# EAGLE design JabberAmplifier (EAGLE 5.11)
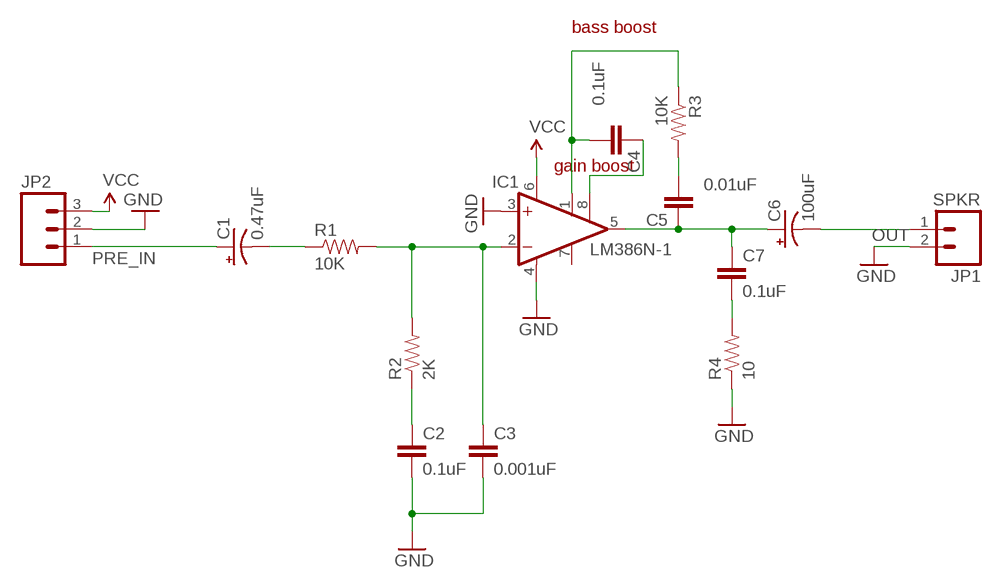
[diagram p0: schematic, sheet 1]

## Parts
C1  0.47uF  CAP_POLPTH2  [CPOL-RADIAL-10UF-25V]
C2  0.1uF  CAPPTH  [CAP-PTH-SMALL]
C3  0.001uF  CAPPTH  [CAP-PTH-SMALL]
C4  0.1uF  CAPPTH  [CAP-PTH-SMALL]
C5  0.01uF  CAPPTH  [CAP-PTH-SMALL]
C6  100uF  CAP_POLPTH2  [CPOL-RADIAL-10UF-25V]
C7  0.1uF  CAPPTH  [CAP-PTH-SMALL]
IC1  LM386N-1  [DIL08]
JP1  SPKR  M02POLAR_LOCK  [MOLEX-1X2_LOCK]
JP2  M03POLAR  [MOLEX-1X3]
R1  10K  RESISTORAXIAL-0.3  [AXIAL-0.3]
R2  2K  RESISTORAXIAL-0.3  [AXIAL-0.3]
R3  10K  RESISTORAXIAL-0.3  [AXIAL-0.3]
R4  10  RESISTORAXIAL-0.3  [AXIAL-0.3]

## Nets
GND: C2.2 C3.2 IC1.3(+IN) IC1.4(GND) JP1.2 JP2.2 R4.P$1
N$1: C1.2(-) R1.P$1
N$2: C3.1 IC1.2(-IN) R1.P$2 R2.P$2
N$3: C2.1 R2.P$1
N$4: C5.1 C6.1(+) C7.1 IC1.5(OUT)
N$5: C7.2 R4.P$2
N$6: C4.1 IC1.8(GAIN)
N$7: C5.2 R3.P$2
N$8: C4.2 IC1.1(GAIN) R3.P$1
OUT: C6.2(-) JP1.1
PRE_IN: C1.1(+) JP2.1
VCC: IC1.6(VS) JP2.3
Unconnected: IC1.7(BYPASS)

## Notes on the sheet
- bass boost
- gain boost

## Library data of the parts
C1 C6 = SparkFun:CAP_POL: Capacitor Polarized These are standard SMD and PTH capacitors. Normally 10uF, 47uF, and 100uF in electrolytic and tantalum varieties. Always verify the external diameter of the through hole cap, it varies with capacity, voltage, and manufacturer. The EIA devices should be standard.
C2-C5 C7 = SparkFun:CAP: Capacitor Standard 0603 ceramic capacitor, and 0.1" leaded capacitor.
IC1 = linear:LM386?-*: Low Voltage Audio Power Amplifier Source: http://cache.national.com/ds/LM/LM386.pdf
JP1 = SparkFun:M02: Header 2 Standard 2-pin 0.1" header. Use with straight break away headers (SKU : PRT-00116), right angle break away headers (PRT-00553), swiss pins (PRT-00743), machine pins (PRT-00117), and female headers (PRT-00115). Molex polarized connector foot print use with SKU : PRT-08233 with associated crimp pins and housings.
JP2 = SparkFun:M03: Header 3 Standard 3-pin 0.1" header. Use with straight break away headers (SKU : PRT-00116), right angle break away headers (PRT-00553), swiss pins (PRT-00743), machine pins (PRT-00117), and female headers (PRT-00115). Molex polarized connector foot print use with SKU : PRT-08232 with associated crimp pins and housings.
R1-R4 = SparkFun:RESISTOR: Resistor Basic schematic elements and footprints for 0603, 1206, and PTH resistors.

## Board
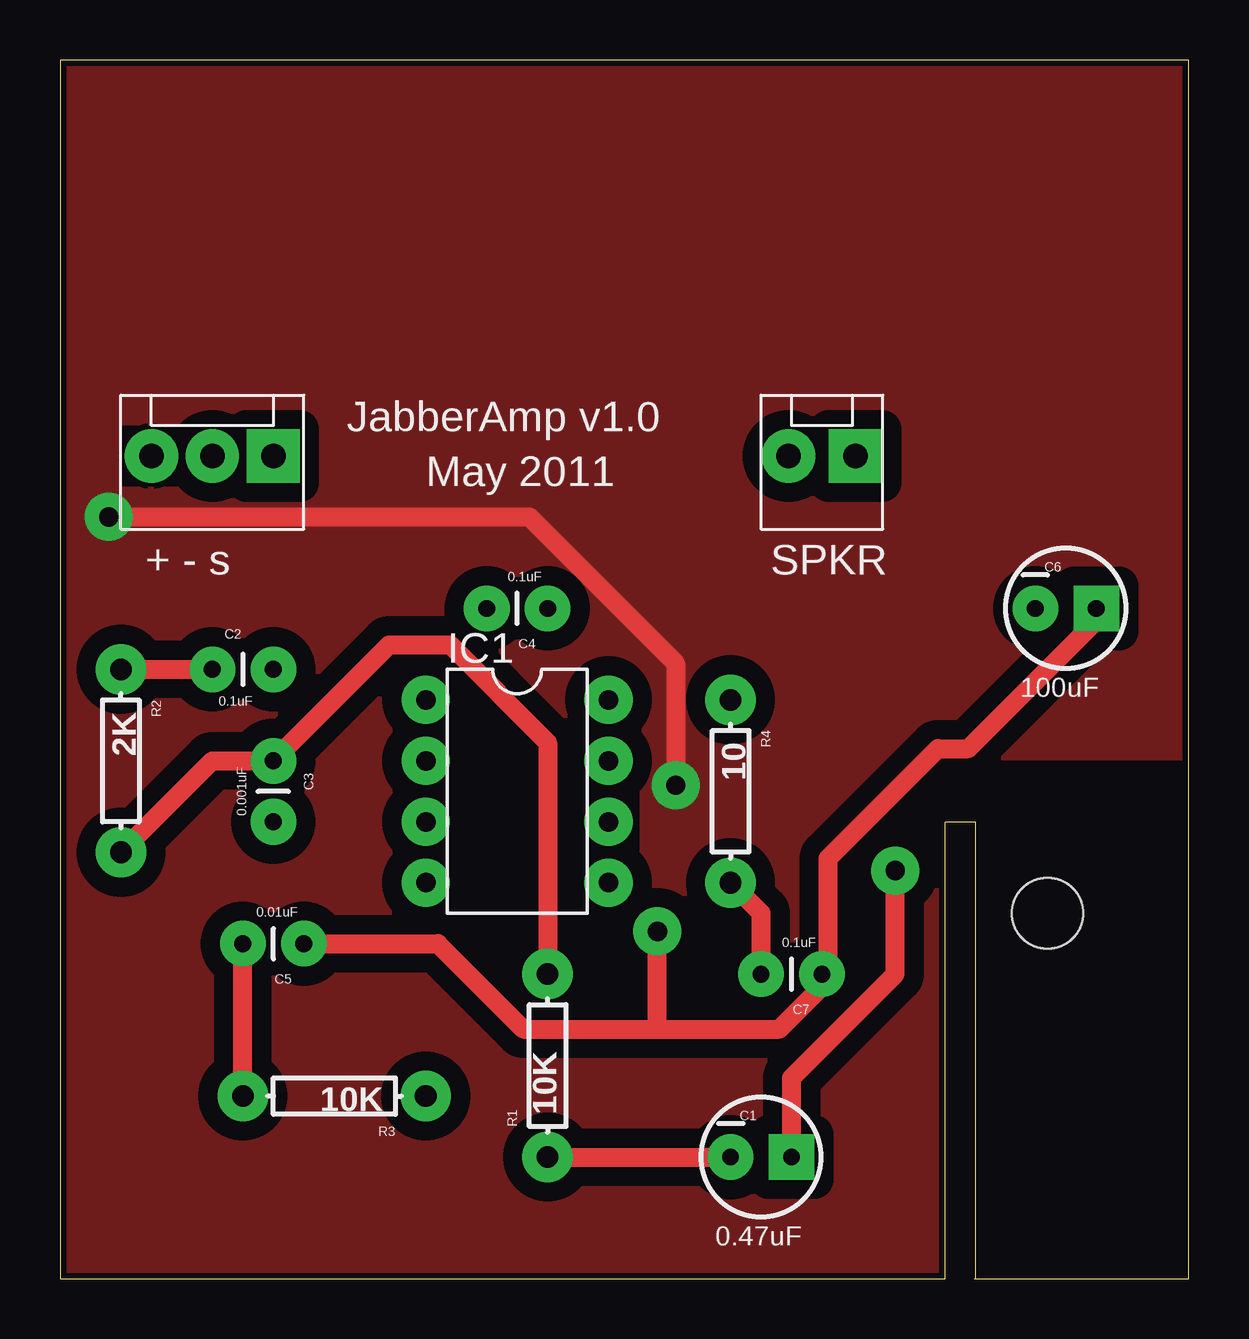
[diagram p1: board, top side]
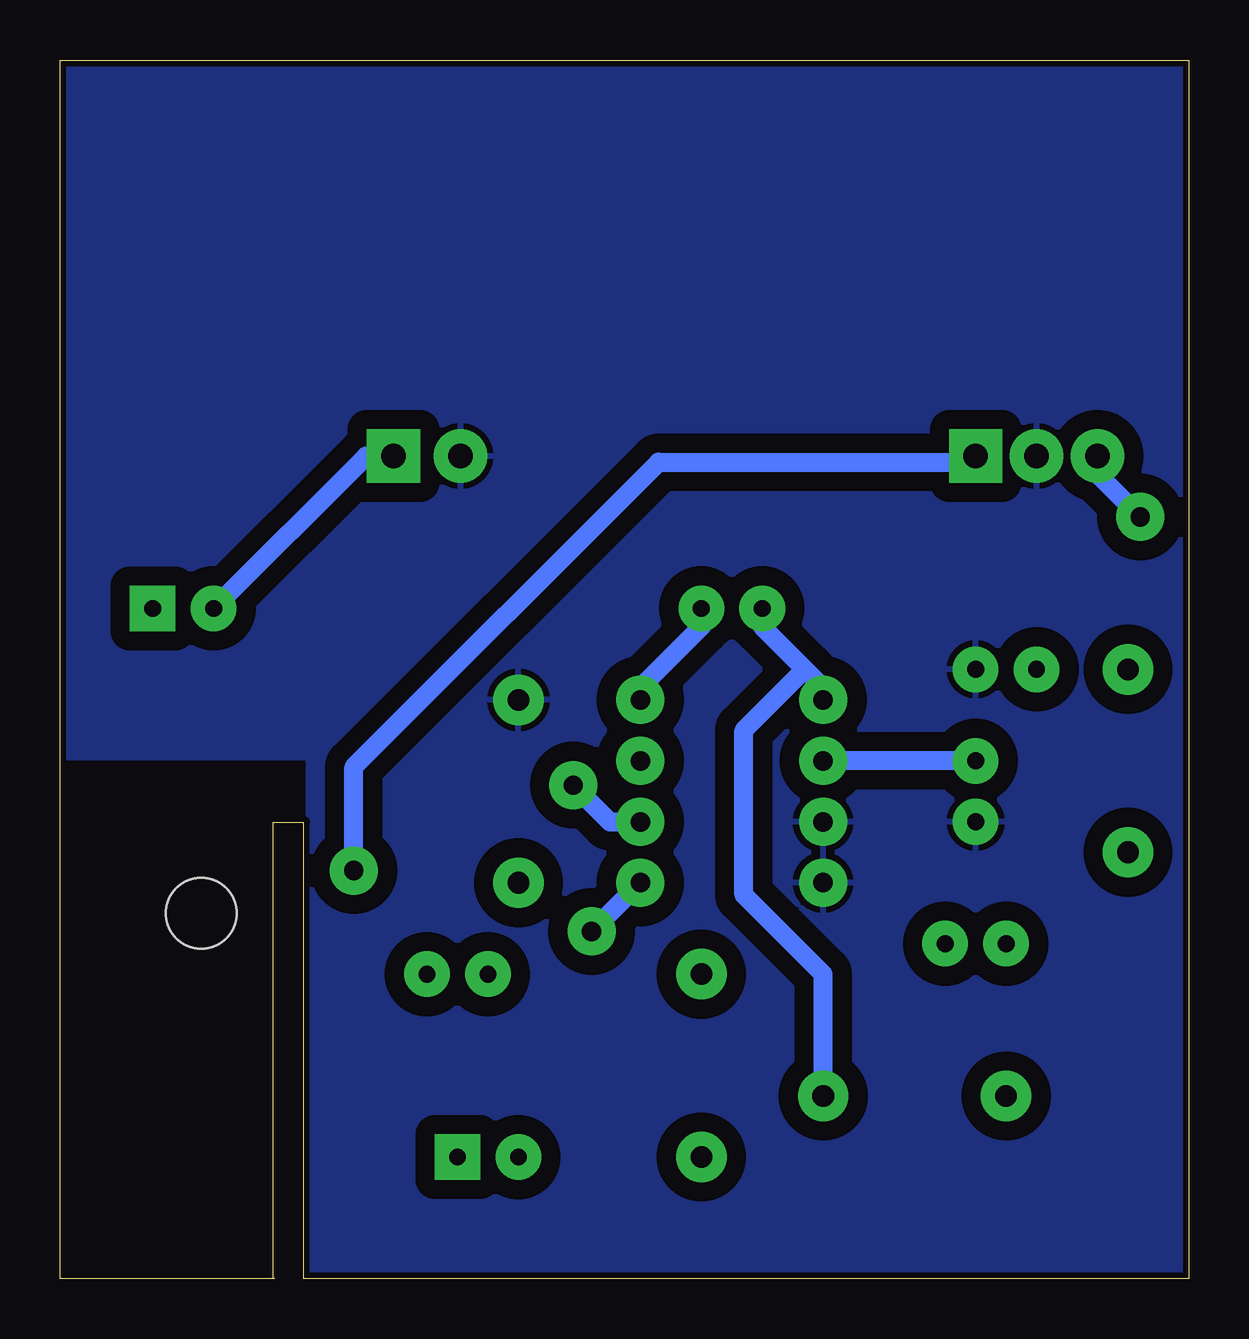
[diagram p2: board, bottom side, seen from below]

Size 47.04 x 50.79 mm. Coordinates in mm from the lower left corner, seen from the top.
Outline: 38.15,0 38.15,19.04 36.88,19.04 36.88,0 0,0 0,50.79 47.04,50.79 47.04,0 38.1,0
Copper layers (1*16): Top 0.035mm / dielectric 1.5mm / Bottom 0.035mm
Design rules "hobby": minimum track width 0.8mm, minimum drill 0.8mm, track to track 0.8mm, track to pad 0.8mm, pad to pad 0.45mm, via to via 0.8mm, smd to smd 8mil, copper to edge 10mil, drill to drill 8mil, minimum pad ring 0.6mm, minimum via ring 0.6mm, stop-mask expansion 4mil, vias tented up to drill 25mil, thermal gap 10mil
Holes 2.95 mm at 41.15,15.24
tRestrict: area 36.8,-1.3 to 48.3,21.6; area 2.5,33 to 10.2,35.6; area 29.2,33 to 34.3,35.6; area 14,15.2 to 16.5,25.4; area 21.6,15.2 to 24.1,25.4
bRestrict: area 36.8,-1.3 to 48.3,21.6

### Footprints (pad centres in the part's own frame; a part is rotated, then mirrored left to right if it is on the bottom)
CPOL-RADIAL-10UF-25V = drill 0.7 pad 1.651 square: 1 1.27,0 | drill 0.7 pad 1.651 round: 2 -1.27,0
CAP-PTH-SMALL = drill 0.7 pad 1.651 round: 1 0,0; 2 2.54,0
DIL08 = drill 0.813 pad 1.27 round: 1 -3.81,-3.81; 2 -1.27,-3.81; 3 1.27,-3.81; 4 3.81,-3.81; 5 3.81,3.81; 6 1.27,3.81; 7 -1.27,3.81; 8 -3.81,3.81
MOLEX-1X2_LOCK = drill 1.016 pad 1.88 square: 1 -0.127,0 | drill 1.016 pad 1.88 round: 2 2.667,0
MOLEX-1X3 = drill 1.016 pad 1.88 square: 1 0,0 | drill 1.016 pad 1.88 round: 2 2.54,0; 3 5.08,0
AXIAL-0.3 = drill 0.9 pad 1.88 round: P$1 -3.81,0; P$2 3.81,0

### Placement (x,y rotation side)
C1  29.21,5.08 0 top
C2  6.35,25.4 0 top
C3  8.89,21.59 270 top
C4  20.32,27.94 180 top
C5  10.16,13.97 180 top
C6  41.91,27.94 0 top
C7  31.75,12.7 180 top
IC1  19.05,20.32 270 top
JP1  33.02,34.29 180 top
JP2  8.89,34.29 180 top
R1  20.32,8.89 90 top
R2  2.54,21.59 270 top
R3  11.43,7.62 180 top
R4  27.94,20.32 270 top

### Tracks (layer width: path | path; a pad name or v marks a point on that pad's centre or on a via)
GND
  pour Bottom: -1.27,52.07 48.26,52.07 48.26,21.59 36.83,21.59 36.83,-1.27 -1.27,-1.27
N$1
  Top 0.8: R1.P$1 C1.2
N$2
  Top 0.8: R2.P$2 6.35,21.59 C3.1 13.72,26.42 16.26,26.42 20.32,22.35 R1.P$2
  Bottom 0.8: C3.1 IC1.2
N$3
  Top 0.8: R2.P$1 C2.1
N$4  (via drill 0.8)
  Top 0.8: C5.1 15.75,13.97 19.3,10.41 24.89,10.41 | 24.89,10.41 29.97,10.41 31.75,12.19 C7.1 32,12.95 32,17.53 36.58,22.1 37.85,22.1 43.18,27.43 C6.1 | 24.89,10.41 v24.89,14.48
  Bottom 0.8: v24.89,14.48 IC1.5
N$5
  Top 0.8: C7.2 29.21,15.24 R4.P$2
N$6
  Bottom 0.8: C4.1 20.32,27.18 22.86,24.64 IC1.8
N$7
  Top 0.8: R3.P$2 C5.2
N$8
  Bottom 0.8: C4.2 17.78,27.18 16,25.4 | 16,25.4 15.24,24.64 IC1.1 | R3.P$1 15.24,12.7 18.54,16 18.54,22.86 16,25.4
OUT
  Bottom 0.8: C6.2 34.29,34.29 JP1.1
PRE_IN  (via drill 0.8)
  Top 0.8: C1.1 30.48,8.38 34.8,12.7 v34.8,17.02
  Bottom 0.8: v34.8,17.02 34.8,21.34 22.1,34.04 9.14,34.04 JP2.1
VCC  (via drill 0.8)
  Top 0.8: v25.65,20.57 25.65,25.65 19.56,31.75 v2.03,31.75
  Bottom 0.8: IC1.6 24.13,19.05 v25.65,20.57 | v2.03,31.75 3.81,33.53 JP2.3
  pour Top: -1.27,52.07 48.26,52.07 48.26,21.59 36.83,21.59 36.83,-1.27 -2.54,-1.27 -2.54,52.07

### Text on the board
tPlace: JabberAmp v1.0 | May 2011 | + - s | SPKR